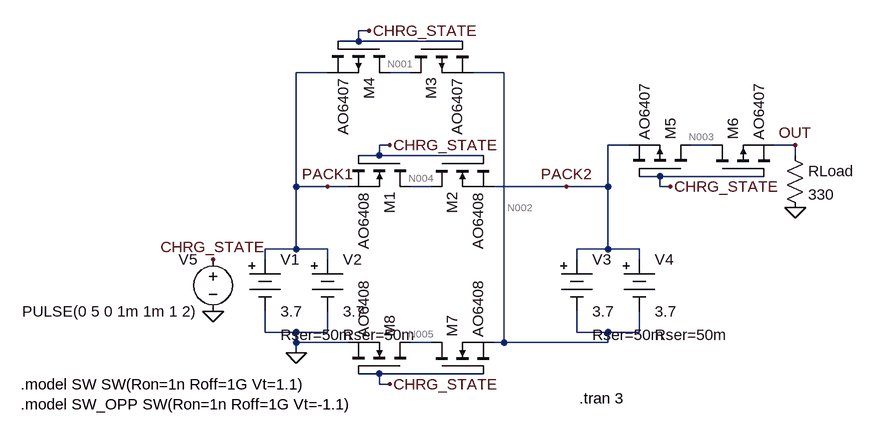
[diagram p0: schematic Battery_Pack_Rearrangement_FET.asc]
Battery_Pack_Rearrangement_FET.asc, the LTspice schematic file:
Version 4
SHEET 1 1100 680
WIRE 208 -288 192 -288
WIRE 192 -272 192 -288
WIRE 192 -272 160 -272
WIRE 352 -272 192 -272
WIRE 144 -224 96 -224
WIRE 272 -224 240 -224
WIRE 416 -224 368 -224
WIRE 240 -112 224 -112
WIRE 608 -112 576 -112
WIRE 736 -112 704 -112
WIRE 864 -112 832 -112
WIRE 224 -96 224 -112
WIRE 224 -96 192 -96
WIRE 384 -96 224 -96
WIRE 864 -96 864 -112
WIRE 656 -64 624 -64
WIRE 816 -64 656 -64
WIRE 96 -48 96 -224
WIRE 144 -48 96 -48
WIRE 176 -48 144 -48
WIRE 304 -48 272 -48
WIRE 512 -48 400 -48
WIRE 576 -48 576 -112
WIRE 576 -48 512 -48
WIRE 656 -48 656 -64
WIRE 672 -48 656 -48
WIRE 96 48 96 -48
WIRE 96 48 48 48
WIRE 144 48 96 48
WIRE 576 48 576 -48
WIRE 576 48 528 48
WIRE 624 48 576 48
WIRE 48 64 48 48
WIRE 144 64 144 48
WIRE 528 64 528 48
WIRE 624 64 624 48
WIRE 48 176 48 144
WIRE 96 176 48 176
WIRE 144 176 144 144
WIRE 144 176 96 176
WIRE 528 176 528 144
WIRE 576 176 528 176
WIRE 624 176 624 144
WIRE 624 176 576 176
WIRE 96 192 96 176
WIRE 176 192 96 192
WIRE 304 192 272 192
WIRE 416 192 416 -224
WIRE 416 192 400 192
WIRE 576 192 576 176
WIRE 576 192 416 192
WIRE 96 208 96 192
WIRE 224 240 192 240
WIRE 384 240 224 240
WIRE 224 256 224 240
WIRE 240 256 224 256
FLAG 96 208 0
FLAG 864 -16 0
FLAG -32 144 0
FLAG -32 64 CHRG_STATE
FLAG 512 -48 PACK2
FLAG 144 -48 PACK1
FLAG 864 -112 OUT
FLAG 672 -48 CHRG_STATE
FLAG 208 -288 CHRG_STATE
FLAG 240 256 CHRG_STATE
FLAG 240 -112 CHRG_STATE
SYMBOL Misc\\battery 48 48 R0
WINDOW 123 0 0 Left 2
WINDOW 39 24 132 Left 2
SYMATTR InstName V1
SYMATTR Value 3.7
SYMATTR SpiceLine Rser=50m
SYMBOL Misc\\battery 144 48 R0
WINDOW 123 0 0 Left 2
WINDOW 39 24 132 Left 2
SYMATTR InstName V2
SYMATTR Value 3.7
SYMATTR SpiceLine Rser=50m
SYMBOL Misc\\battery 528 48 R0
WINDOW 123 0 0 Left 2
WINDOW 39 24 132 Left 2
SYMATTR InstName V3
SYMATTR Value 3.7
SYMATTR SpiceLine Rser=50m
SYMBOL Misc\\battery 624 48 R0
WINDOW 123 0 0 Left 2
WINDOW 39 24 132 Left 2
SYMATTR InstName V4
SYMATTR Value 3.7
SYMATTR SpiceLine Rser=50m
SYMBOL res 848 -112 R0
SYMATTR InstName RLoad
SYMATTR Value 330
SYMBOL voltage -32 48 M0
WINDOW 123 0 0 Left 2
WINDOW 39 0 0 Left 2
SYMATTR InstName V5
SYMATTR Value PULSE(0 5 0 1m 1m 1 2)
SYMBOL nmos 272 -96 R90
SYMATTR InstName M1
SYMATTR Value AO6408
SYMBOL nmos 304 -96 M90
SYMATTR InstName M2
SYMATTR Value AO6408
SYMBOL pmos 272 -272 M90
SYMATTR InstName M3
SYMATTR Value AO6407
SYMBOL pmos 240 -272 R90
SYMATTR InstName M4
SYMATTR Value AO6407
SYMBOL pmos 704 -64 M270
SYMATTR InstName M5
SYMATTR Value AO6407
SYMBOL pmos 736 -64 R270
SYMATTR InstName M6
SYMATTR Value AO6407
SYMBOL nmos 304 240 R270
SYMATTR InstName M7
SYMATTR Value AO6408
SYMBOL nmos 272 240 M270
SYMATTR InstName M8
SYMATTR Value AO6408
TEXT -328 256 Left 2 !.model SW SW(Ron=1n Roff=1G Vt=1.1)\n.model SW_OPP SW(Ron=1n Roff=1G Vt=-1.1)
TEXT 532 278 Left 2 !.tran 3

The netlist it stands for:
* Battery_Pack_Rearrangement_FET.asc
V1 PACK1 0 3.7 Rser=50m
V2 PACK1 0 3.7 Rser=50m
V3 PACK2 N002 3.7 Rser=50m
V4 PACK2 N002 3.7 Rser=50m
RLoad OUT 0 330
V5 CHRG_STATE 0 PULSE(0 5 0 1m 1m 1 2)
M1 N004 CHRG_STATE PACK1 PACK1 AO6408
M2 N004 CHRG_STATE PACK2 PACK2 AO6408
M3 N001 CHRG_STATE N002 N002 AO6407
M4 N001 CHRG_STATE PACK1 PACK1 AO6407
M5 N003 CHRG_STATE PACK2 PACK2 AO6407
M6 N003 CHRG_STATE OUT OUT AO6407
M7 N005 CHRG_STATE N002 N002 AO6408
M8 N005 CHRG_STATE 0 0 AO6408
.model NMOS NMOS
.model PMOS PMOS
.lib standard.mos
.model SW SW(Ron=1n Roff=1G Vt=1.1)
.model SW_OPP SW(Ron=1n Roff=1G Vt=-1.1)
.tran 3
.backanno
.end

* Results of the author's LTspice run, read from the files saved beside the schematic
* Operating Point, zero values left out:
*   V(pack1) = 3.699 V
*   V(pack2) = 7.397 V
*   V(n002) = 3.698 V
*   V(out) = 7.396 V
*   V(n004) = 7.377 V
*   V(n001) = 3.699 V
*   V(n003) = 7.397 V
*   V(n005) = 3.612 V
*   Id(M6) = 22.41 mA
*   Is(M6) = -22.41 mA
*   Id(M5) = -22.41 mA
*   Is(M5) = 22.41 mA
*   Id(M4) = -22.41 mA
*   Is(M4) = 22.41 mA
*   Id(M3) = 22.41 mA
*   Is(M3) = -22.41 mA
*   Id(M8) = 967.1 pA
*   Is(M8) = -967.1 pA
*   Id(M7) = -970.8 pA
*   Is(M7) = 970.8 pA
*   Id(M2) = -43.67 pA
*   Is(M2) = 43.67 pA
*   Id(M1) = 39.67 pA
*   Is(M1) = -39.67 pA
*   I(Rload) = 22.41 mA
*   I(V4) = -11.21 mA
*   I(V3) = -11.21 mA
*   I(V2) = -11.21 mA
*   I(V1) = -11.21 mA
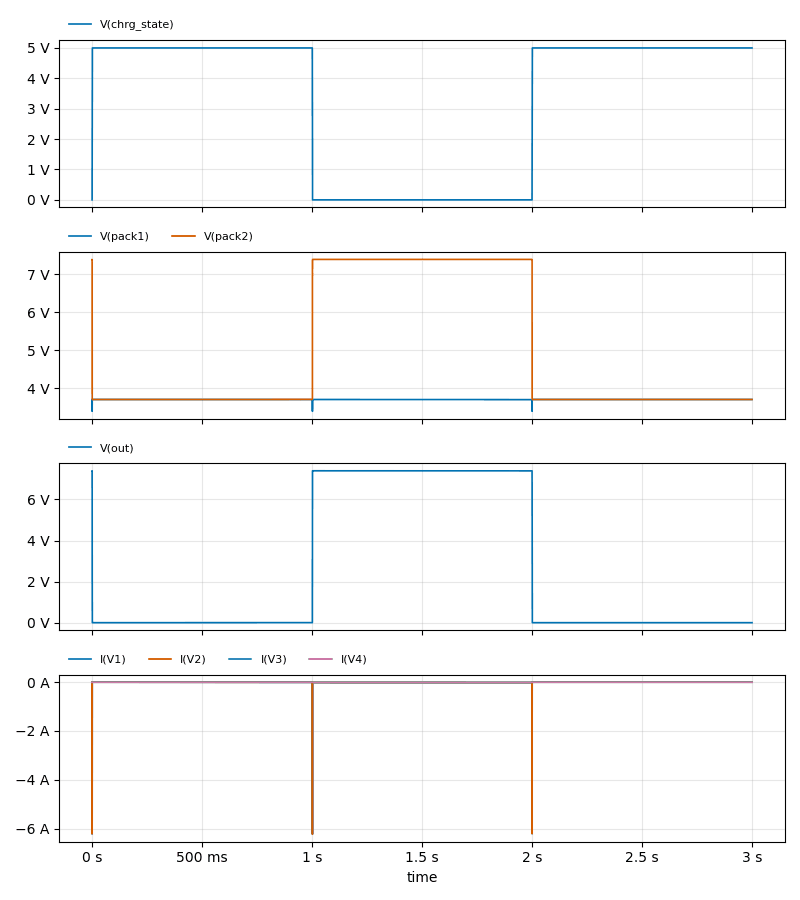
[diagram p1: Transient Analysis of Battery_Pack_Rearrangement_FET.asc, plotted from the saved traces]
* Transient Analysis, 1 run:
*   V(chrg_state): min 0 V, max 5 V, average 3.334 V, rms 4.082 V, last 5 V
*   V(pack1): min 3.388 V, max 3.7 V, average 3.7 V, rms 3.7 V, last 3.7 V
*   V(pack2): min 3.7 V, max 7.397 V, average 4.931 V, rms 5.23 V, last 3.7 V
*   V(out): min -1.645 mV, max 7.396 V, average 2.464 V, rms 4.268 V, last 0 V
*   I(V1): min -6.23 A, max 101.5 µA, average -4.653 mA, rms 60.17 mA, last 0 A
*   I(V2): min -6.23 A, max 101.5 µA, average -4.653 mA, rms 60.17 mA, last 0 A
*   I(V3): min -11.22 mA, max 101.5 µA, average -3.733 mA, rms 6.467 mA, last 0 A
*   I(V4): min -11.22 mA, max 101.5 µA, average -3.733 mA, rms 6.467 mA, last 0 A